# EAGLE schematic MC-10 Schematics (EAGLE 7.2.0)
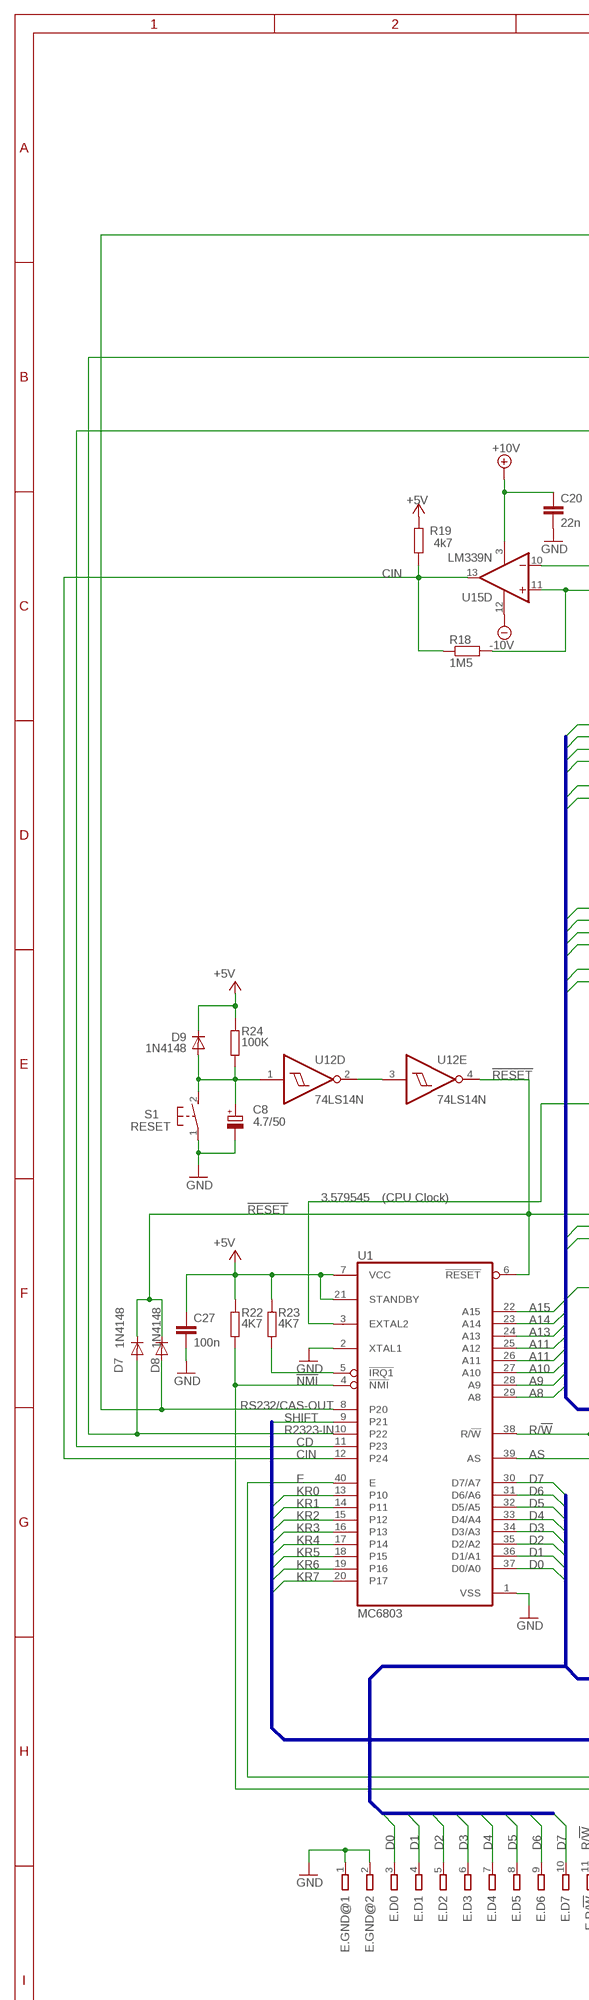
[diagram p0: schematic, sheet 1, part 1 of 2]
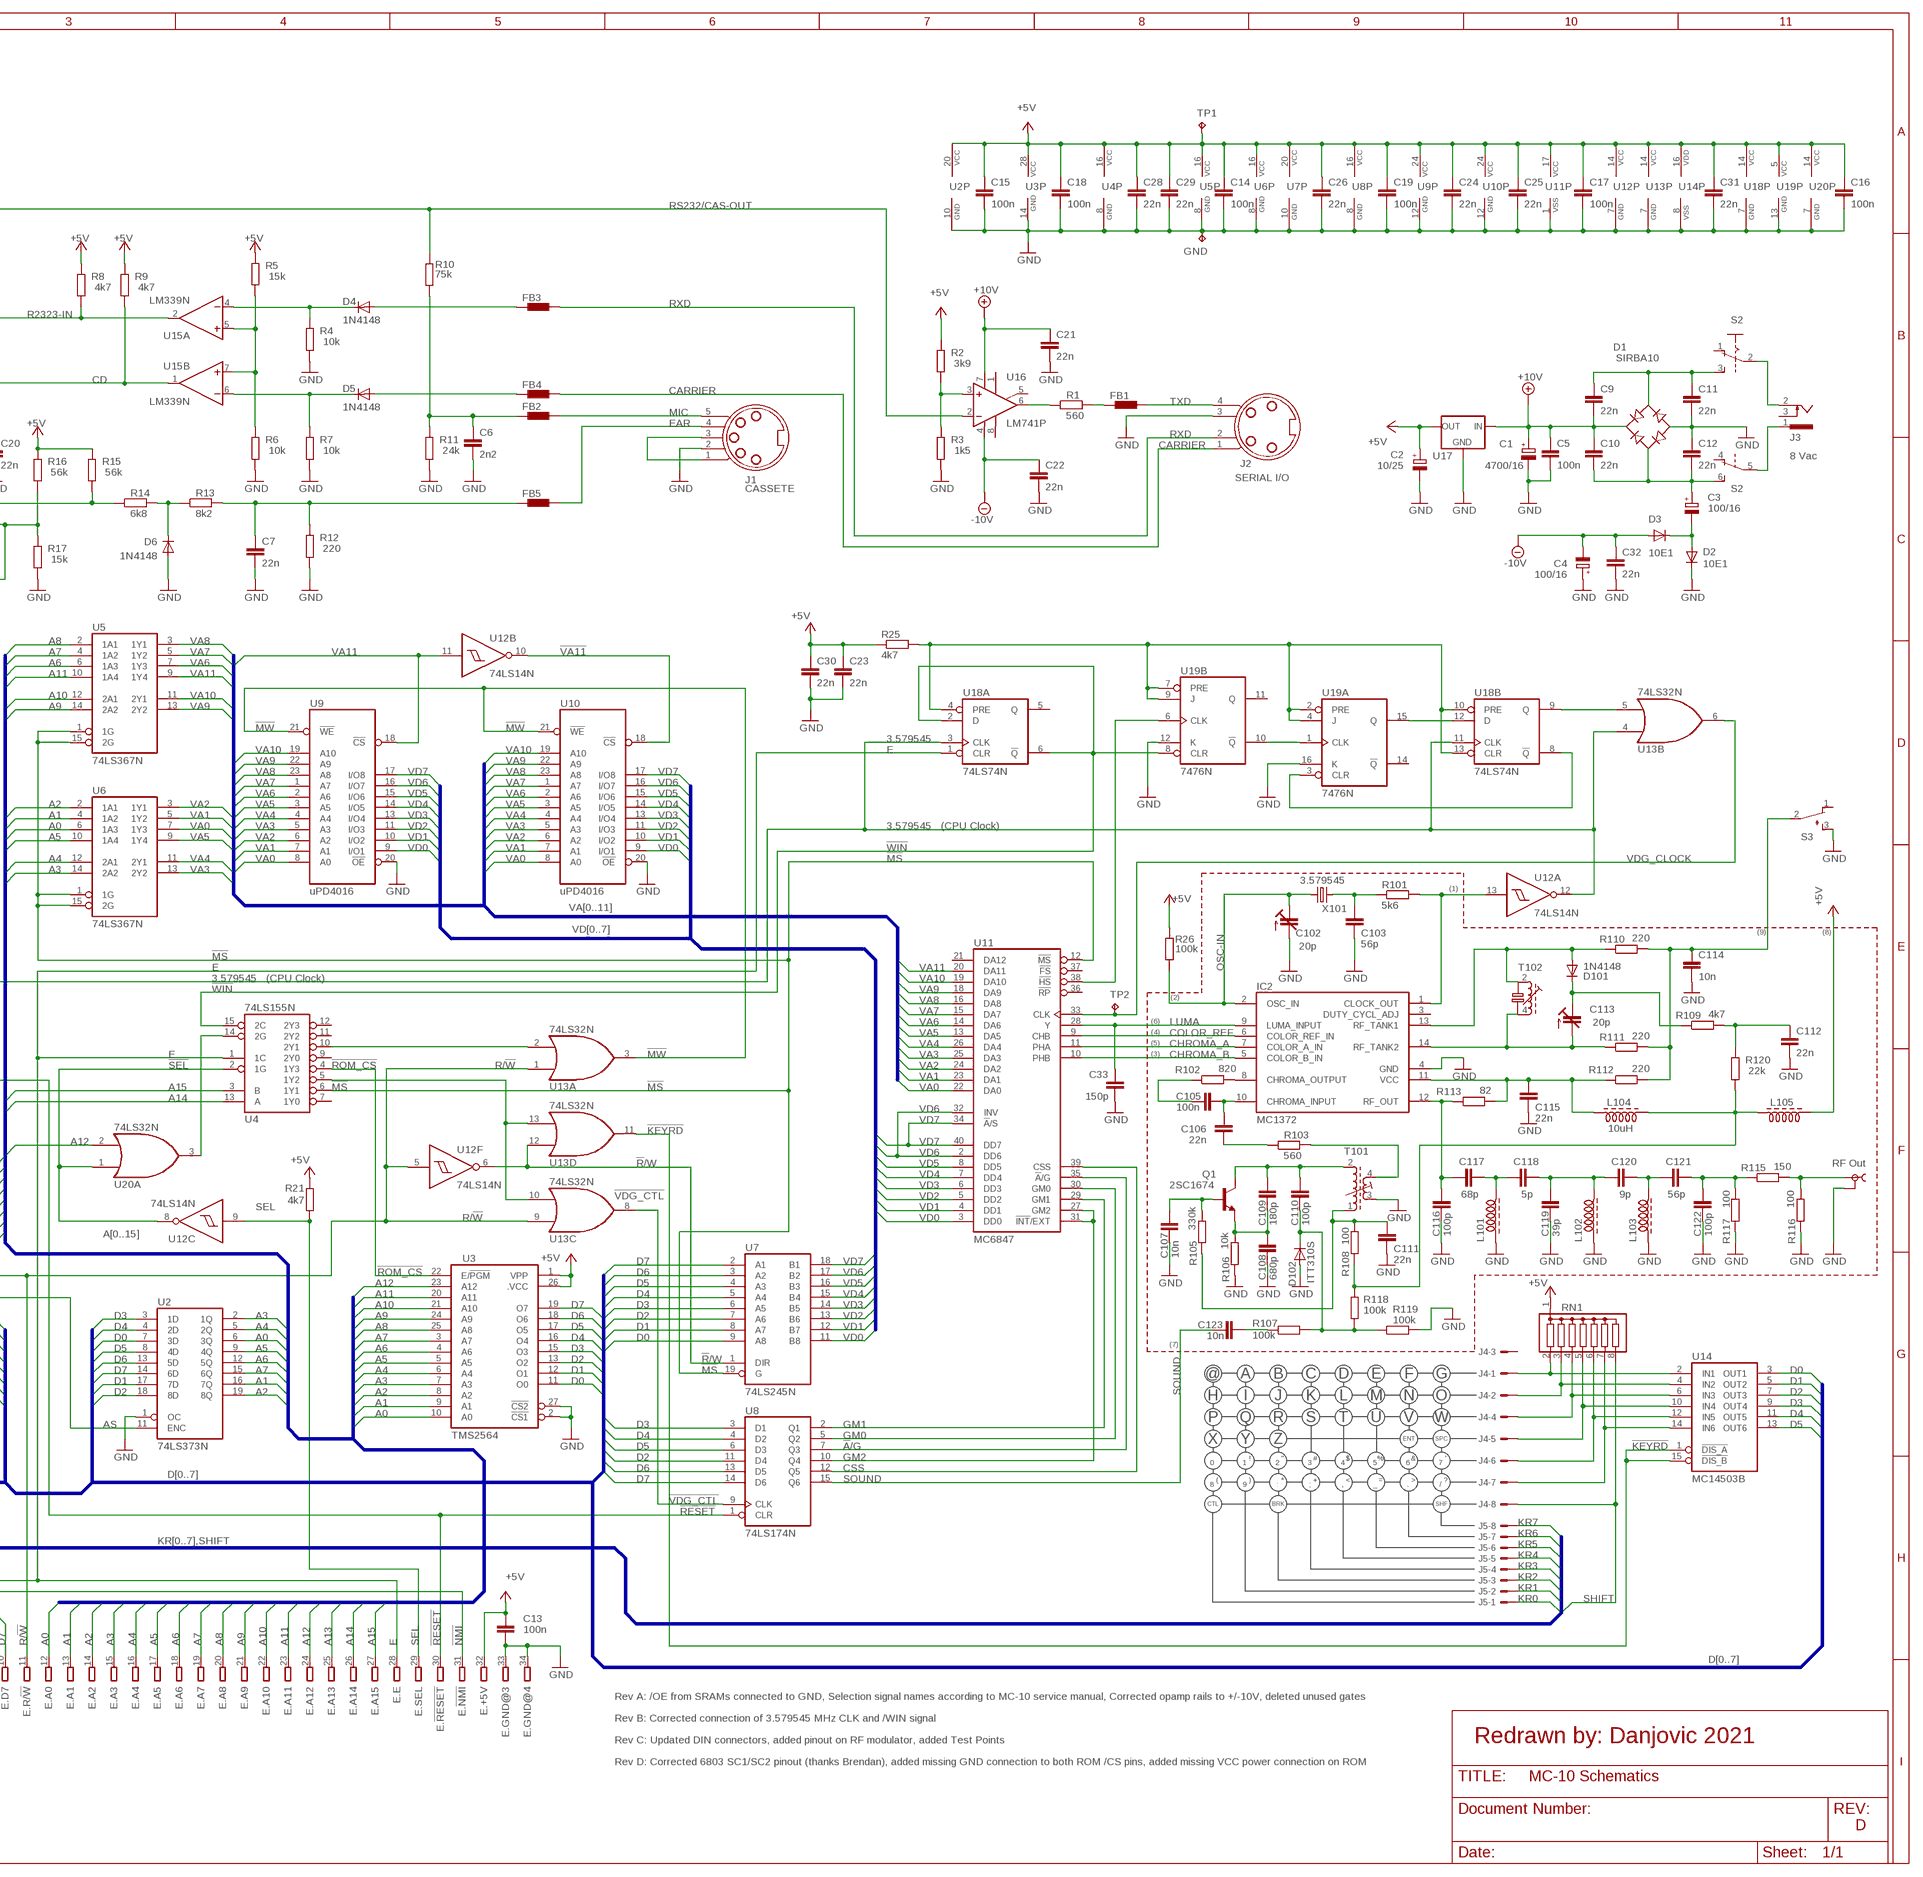
[diagram p1: schematic, sheet 1, part 2 of 2]

## Parts
C1  4700/16  CPOL-EUE7.5-18  [E7,5-18]
C2  10/25  CPOL-EUE1.8-4  [E1,8-4]
C3  100/16  CPOL-EUE15-5AXIAL  [E15-5]
C4  100/16  CPOL-EUE15-5AXIAL  [E15-5]
C5  100n  C-EU050-024X044  [C050-024X044]
C6  2n2  C-EU050-024X044  [C050-024X044]
C7  22n  C-EU050-024X044  [C050-024X044]
C8  4.7/50  CPOL-EUE1.8-4  [E1,8-4]
C9  22n  C-EU050-024X044  [C050-024X044]
C10  22n  C-EU050-024X044  [C050-024X044]
C11  22n  C-EU050-024X044  [C050-024X044]
C12  22n  C-EU050-024X044  [C050-024X044]
C13  100n  C-EU050-024X044  [C050-024X044]
C14  100n  C-EU050-024X044  [C050-024X044]
C15  100n  C-EU050-024X044  [C050-024X044]
C16  100n  C-EU050-024X044  [C050-024X044]
C17  100n  C-EU050-024X044  [C050-024X044]
C18  100n  C-EU050-024X044  [C050-024X044]
C19  100n  C-EU050-024X044  [C050-024X044]
C20  22n  C-EU050-024X044  [C050-024X044]
C21  22n  C-EU050-024X044  [C050-024X044]
C22  22n  C-EU050-024X044  [C050-024X044]
C23  22n  C-EU050-024X044  [C050-024X044]
C24  22n  C-EU050-024X044  [C050-024X044]
C25  22n  C-EU050-024X044  [C050-024X044]
C26  22n  C-EU050-024X044  [C050-024X044]
C27  100n  C-EU050-024X044  [C050-024X044]
C28  22n  C-EU050-024X044  [C050-024X044]
C29  22n  C-EU050-024X044  [C050-024X044]
C30  22n  C-EU050-024X044  [C050-024X044]
C31  22n  C-EU050-024X044  [C050-024X044]
C32  22n  C-EU050-024X044  [C050-024X044]
C33  150p  C-EU025-024X044  [C025-024X044]
C102  20p  C-TRIMM3008  [3008]
C103  56p  C-EU025-024X044  [C025-024X044]
C105  100n  C-EU050-024X044  [C050-024X044]
C106  22n  C-EU050-024X044  [C050-024X044]
C107  10n  C-EU025-024X044  [C025-024X044]
C108  680p  C-EU025-024X044  [C025-024X044]
C109  180p  C-EU025-024X044  [C025-024X044]
C110  100p  C-EU025-024X044  [C025-024X044]
C111  22n  C-EU025-024X044  [C025-024X044]
C112  22n  C-EU025-024X044  [C025-024X044]
C113  20p  C-TRIMM3008  [3008]
C114  10n  C-EU025-024X044  [C025-024X044]
C115  22n  C-EU025-024X044  [C025-024X044]
C116  100p  C-EU025-024X044  [C025-024X044]
C117  68p  C-EU025-024X044  [C025-024X044]
C118  5p  C-EU025-024X044  [C025-024X044]
C119  39p  C-EU025-024X044  [C025-024X044]
C120  9p  C-EU025-024X044  [C025-024X044]
C121  56p  C-EU025-024X044  [C025-024X044]
C122  100p  C-EU025-024X044  [C025-024X044]
C123  10n  C-EU025-024X044  [C025-024X044]
D1  SIRBA10  RECTIFIER-SKBB  [SKBB]
D2  10E1  DIODE-D-7.5  [D-7.5]
D3  10E1  DIODE-D-7.5  [D-7.5]
D4  1N4148  1N4148DO35-7  [DO35-7]
D5  1N4148  1N4148DO35-7  [DO35-7]
D6  1N4148  1N4148DO35-7  [DO35-7]
D7  1N4148  1N4148DO35-7  [DO35-7]
D8  1N4148  1N4148DO35-7  [DO35-7]
D9  1N4148  1N4148DO35-7  [DO35-7]
D101  1N4148  1N4148DO35-7  [DO35-7]
D102  ITT310S  1N4148DO35-7  [DO35-7]
E.  EXPANSION  [EXPANSION_PORT]
FB1  BL01RN1A  [BL01RN1A]
FB2  BL01RN1A  [BL01RN1A]
FB3  BL01RN1A  [BL01RN1A]
FB4  BL01RN1A  [BL01RN1A]
FB5  BL01RN1A  [BL01RN1A]
GND  TPPAD1-13  [P1-13]
IC2  MC1372  [DIL14]
J1  DS-4-05  [MC-10_DIN05S]
J2  DS-4-04  [MC-10_DIN04S]
J3  733980-62  [733980-62]
J4  22-27-2081-08  [6410-08]
J5  22-27-2081-08  [6410-08]
L101  Z15/05CCW  [Z15/05]
L102  Z15/05CCW  [Z15/05]
L103  Z15/05CCW  [Z15/05]
L104  10uH  Z15/05CCW  [Z15/05]
L105  10uH  Z15/05CCW  [Z15/05]
Q1  2SC1674  BF494-NPN-TO92-CEB  [TO92-CEB]
R1  560  R-EU_0204/7  [0204/7]
R2  3k9  R-EU_0204/7  [0204/7]
R3  1k5  R-EU_0204/7  [0204/7]
R4  10k  R-EU_0204/7  [0204/7]
R5  15k  R-EU_0204/7  [0204/7]
R6  10k  R-EU_0204/7  [0204/7]
R7  10k  R-EU_0204/7  [0204/7]
R8  4k7  R-EU_0204/7  [0204/7]
R9  4k7  R-EU_0204/7  [0204/7]
R10  75k  R-EU_0204/7  [0204/7]
R11  24k  R-EU_0204/7  [0204/7]
R12  220  R-EU_0204/7  [0204/7]
R13  8k2  R-EU_0204/7  [0204/7]
R14  6k8  R-EU_0204/7  [0204/7]
R15  56k  R-EU_0204/7  [0204/7]
R16  56k  R-EU_0204/7  [0204/7]
R17  15k  R-EU_0204/7  [0204/7]
R18  1M5  R-EU_0204/7  [0204/7]
R19  4k7  R-EU_0204/7  [0204/7]
R21  4k7  R-EU_0204/7  [0204/7]
R22  4K7  R-EU_0204/7  [0204/7]
R23  4K7  R-EU_0204/7  [0204/7]
R24  100K  R-EU_0204/7  [0204/7]
R25  4k7  R-EU_0204/7  [0204/7]
R26  100k  R-EU_0204/7  [0204/7]
R101  5k6  R-EU_0204/7  [0204/7]
R102  820  R-EU_0204/7  [0204/7]
R103  560  R-EU_0204/7  [0204/7]
R105  330k  R-EU_0204/7  [0204/7]
R106  10k  R-EU_0204/7  [0204/7]
R107  100k  R-EU_0204/7  [0204/7]
R108  100  R-EU_0204/7  [0204/7]
R109  4k7  R-EU_0204/7  [0204/7]
R110  220  R-EU_0204/7  [0204/7]
R111  220  R-EU_0204/7  [0204/7]
R112  220  R-EU_0204/7  [0204/7]
R113  82  R-EU_0204/7  [0204/7]
R115  150  R-EU_0204/7  [0204/7]
R116  100  R-EU_0204/7  [0204/7]
R117  100  R-EU_0204/7  [0204/7]
R118  100k  R-EU_0204/7  [0204/7]
R119  100k  R-EU_0204/7  [0204/7]
R120  22k  R-EU_0204/7  [0204/7]
RN1  G07R  [SIL8]
S1  RESET  31-XX  [B3F-31XX]
S2  A68-A31  [A68-A31]
S3  TL32PO  [TL3XPO]
T101  71-4-2143  [71-5]
T102  71K1-2-4  [71K]
TP1  TPPAD1-13  [P1-13]
TP2  TPPAD1-13  [P1-13]
U1  MC6803  MC6803P  [DIL40]
U2  74LS373N  [DIL20]
U3  TMS2564  TMS2564JL  [DIL28]
U4  74LS155N  [DIL16]
U5  74LS367N  74HC367N  [DIL16]
U6  74LS367N  74HC367N  [DIL16]
U7  74LS245N  [DIL20]
U8  74LS174N  [DIL16]
U9  uPD4016  UPD4016"  [DIL24]
U10  uPD4016  UPD4016"  [DIL24]
U11  MC6847  [DIL40]
U12  74LS14N  [DIL14]
U13  74LS32N  [DIL14]
U14  MC14503B  MC14503BN  [DIL16]
U15  LM339N  [DIL14]
U16  LM741P  [DIL08]
U17  78XXL  [78XXL]
U18  74LS74N  [DIL14]
U19  7476N  [DIL16]
U20  74LS32N  [DIL14]
X1  RF Out  TOBU3  [TOBU3]
X101  3.579545  CRYSTALHC49U70  [HC49U70]

## Nets
3.579545: U1.3(EXTAL2) U12.12(A:O) U13.4(B:I0) U18.3(A:CLK) U18.11(B:CLK)
!A!/G: U8.7(Q3) U11.35(!A!/G)
!IRQ: R23.2 U1.5(!IRQ1)
!KEYRD: U13.11(D:O) U14.1(!DIS_A!) U14.15(!DIS_B!)
!MS: U4.6(1Y1) U5.1(1G) U5.15(2G) U6.1(1G) U6.15(2G) U7.19(G) U11.12(!MS)
!MW: U9.21(!WE) U10.21(!WE) U13.3(A:O)
!NMI: E..31 R22.2 U1.4(!NMI)
!R!/W: U7.1(DIR) U12.6(F:O) U13.12(D:I0)
!RESET: D7.C D8.C E..30 U1.6(!RESET!) U8.1(CLR) U12.4(E:O)
!ROM_CS!: U3.22(E/!PGM) U4.4(1Y3)
!SEL: U4.2(1G) U12.8(C:O) U20.1(A:I0)
!VA11: U10.18(!CS) U12.10(B:O)
!VDG_CTL: U8.9(CLK) U13.8(C:O)
!WIN: U4.15(2C) U18.2(A:D) U18.6(A:!Q) U19.8(B:CLR)
+5V: C2.+ C13.1 C14.1 C15.1 C16.1 C17.1 C18.1 C19.1 C23.1 C24.1 C25.1 C26.1 C27.1 C28.1 C29.1 C30.1 C31.1 D9.C E..32 L105.1 R2.2 R5.2 R8.2 R9.2 R15.2 R16.2 R19.2 R21.1 R22.1 R23.1 R24.1 R25.1 R26.2 RN1.1 TP1.TP U1.7(VCC) U1.21(STANDBY) U2.20(VCC) U3.1(VPP) U3.26(.VCC) U3.28(VCC) U4.16(VCC) U5.16(VCC) U6.16(VCC) U7.20(VCC) U8.16(VCC) U9.24(VCC) U10.24(VCC) U11.17(VCC) U12.14(P:VCC) U13.14(P:VCC) U14.16(VDD) U17.OUT U18.14(P:VCC) U19.5(P:VCC) U20.14(P:VCC)
+10V: C1.+ C5.1 C9.2 C10.1 C20.1 C21.1 D1.+ U15.3(P:V+) U16.7(V+) U17.IN
-10V: C4.- C22.1 C32.1 D3.A U15.12(P:GND) U16.4(V-)
A0: E..12 U2.6(3Q) U3.10(A0) U6.6(1A3)
A1: E..13 U2.16(7Q) U3.9(A1) U6.4(1A2)
A2: E..14 U2.19(8Q) U3.8(A2) U6.2(1A1)
A3: E..15 U2.2(1Q) U3.7(A3) U6.14(2A2)
A4: E..16 U2.5(2Q) U3.6(A4) U6.12(2A1)
A5: E..17 U2.9(4Q) U3.5(A5) U6.10(1A4)
A6: E..18 U2.12(5Q) U3.4(A6) U5.6(1A3)
A7: E..19 U2.15(6Q) U3.3(A7) U5.4(1A2)
A8: E..20 U1.29(A8) U3.25(A8) U5.2(1A1)
A9: E..21 U1.28(A9) U3.24(A9) U5.14(2A2)
A10: E..22 U1.27(A10) U3.21(A10) U5.12(2A1)
A11: E..23 U1.25(A12) U1.26(A11) U3.20(A11) U5.10(1A4)
A12: E..24 U3.23(A12) U20.2(A:I1)
A13: E..25 U1.24(A13)
A14: E..26 U1.23(A14) U4.13(A)
A15: E..27 U1.22(A15) U4.3(B)
AS: U1.39(AS) U2.11(ENC)
CARRIER: FB4.2 J2.1
CD: R9.1 U1.11(P23) U15.1(B:OUT)
CHROMA_A: IC2.7(COLOR_A_IN) U11.11(PHA)
CHROMA_B: IC2.5(COLOR_B_IN) U11.10(PHB)
CIN: R18.1 R19.1 U1.12(P24) U15.13(D:OUT)
CLK-OUT: IC2.1(CLOCK_OUT) R101.2 U12.13(A:I)
COLOR_REF: IC2.6(COLOR_REF_IN) U11.9(CHB)
CSS: U8.12(Q5) U11.39(CSS)
D0: E..3 U1.37(D0/A0) U2.7(3D) U3.11(O0) U7.9(A8) U14.3(OUT1)
D1: E..4 U1.36(D1/A1) U2.17(7D) U3.12(O1) U7.8(A7) U14.5(OUT2)
D2: E..5 U1.35(D2/A2) U2.18(8D) U3.13(O2) U7.7(A6) U8.11(D4) U14.7(OUT3)
D3: E..6 U1.34(D3/A3) U2.3(1D) U3.15(O3) U7.6(A5) U8.3(D1) U14.9(OUT4)
D4: E..7 U1.33(D4/A4) U2.4(2D) U3.16(O4) U7.5(A4) U8.4(D2) U14.11(OUT5)
D5: E..8 U1.32(D5/A5) U2.8(4D) U3.17(O5) U7.4(A3) U8.6(D3) U14.13(OUT6)
D6: E..9 U1.31(D6/A6) U2.13(5D) U3.18(O6) U7.3(A2) U8.13(D5)
D7: E..10 U1.30(D7/A7) U2.14(6D) U3.19(O7) U7.2(A1) U8.14(D6)
E: E..28 U1.40(E) U4.1(1C) U18.1(A:CLR)
EAR: FB5.2 J1.4
GM0: U8.5(Q2) U11.30(GM0)
GM1: U8.2(Q1) U11.29(GM1)
GM2: U8.10(Q4) U11.27(GM2) U11.31(!INT!/EXT)
GND: C1.- C2.- C4.+ C5.2 C6.2 C7.2 C8.- C11.2 C12.1 C13.2 C14.2 C15.2 C16.2 C17.2 C18.2 C19.2 C20.2 C21.2 C22.2 C23.2 C24.2 C25.2 C26.2 C27.2 C28.2 C29.2 C30.2 C31.2 C32.2 C33.2 C102.-(A) C103.2 C107.2 C108.2 C111.2 C112.2 C114.2 C115.2 C116.2 C119.2 C122.2 D1.- D2.C D6.A D102.A E..1 E..2 E..33 E..34 GND.TP IC2.4(GND) J1.2 J2.3 L101.1 L102.1 L103.1 R3.1 R4.1 R6.1 R7.1 R11.1 R12.1 R17.1 R106.1 R116.1 R117.1 R119.2 S1.1(P) S3.3(S) T101.3(E2) U1.1(VSS) U1.2(XTAL1) U2.1(OC) U2.10(GND) U3.2(!CS1) U3.14(GND) U3.27(!CS2) U4.8(GND) U5.8(GND) U6.8(GND) U7.10(GND) U8.8(GND) U9.12(GND) U9.20(!OE) U10.12(GND) U10.20(!OE) U11.1(GND) U12.7(P:GND) U13.7(P:GND) U14.8(VSS) U17.GND U18.7(P:GND) U19.12(B:K) U19.13(P:GND) U19.16(A:K) U20.7(P:GND) X1.2 X1.2@1 X1.2@2
KB0: J4.1 RN1.2 U14.2(IN1)
KB1: J4.2 RN1.3 U14.4(IN2)
KB2: J4.4 RN1.4 U14.6(IN3)
KB3: J4.5 RN1.5 U14.10(IN4)
KB4: J4.6 RN1.6 U14.12(IN5)
KB5: J4.7 RN1.7 U14.14(IN6)
KR0: J5.1 U1.13(P10)
KR1: J5.2 U1.14(P11)
KR2: J5.3 U1.15(P12)
KR3: J5.4 U1.16(P13)
KR4: J5.5 U1.17(P14)
KR5: J5.6 U1.18(P15)
KR6: J5.7 U1.19(P16)
KR7: J5.8 U1.20(P17)
LUMA: C33.1 IC2.9(LUMA_INPUT) U11.28(Y)
MIC: FB2.2 J1.5
N$1: IC2.8(CHROMA_OUTPUT) R102.2
N$2: D4.C R4.2 U15.4(A:-IN)
N$4: U4.14(2G) U20.3(A:O)
N$5: R25.2 U18.4(A:PRE) U18.10(B:PRE) U18.13(B:CLR) U19.2(A:PRE) U19.4(A:J) U19.7(B:PRE) U19.9(B:J)
N$6: U4.10(2Y1) U13.2(A:I1)
N$7: U4.5(1Y2) U13.10(C:I1) U13.13(D:I1)
N$8: C105.2 C106.1 IC2.10(CHROMA_INPUT)
N$9: C103.1 R101.1 X101.2
N$10: U18.8(B:!Q) U19.3(A:CLR)
N$12: U19.1(A:CLK) U19.10(B:!Q)
N$13: U18.12(B:D) U19.15(A:Q)
N$14: U13.5(B:I1) U18.9(B:Q)
N$15: C105.1 R102.1
N$16: U11.38(!HS) U19.6(B:CLK)
N$17: C115.1 IC2.11(VCC) L104.2 R112.1 R113.2
N$18: D101.A IC2.13(RF_TANK1) R110.1 T102.2(A)
N$19: C113.-(A) IC2.14(RF_TANK2) R111.1 T102.4(E)
N$20: C113.+(E) D101.C R109.1
N$21: C116.1 C117.1 IC2.12(RF_OUT) R113.1
N$22: C117.2 C118.1 L101.2
N$23: C118.2 C119.1 C120.1 L102.2
N$24: R115.2 R116.2 X1.1
N$25: C120.2 C121.1 L103.2
N$26: C121.2 C122.1 R115.1 R117.2
N$27: C106.2 R103.1
N$28: R103.2 T101.4(A2)
N$29: J3.2 S2.2(A:P)
N$30: C109.1 C110.1 Q1.C T101.2(A1)
N$31: C112.1 R109.2 R120.2
N$32: C107.1 Q1.B R105.2
N$33: C108.1 C109.2 Q1.E R106.2
N$34: C123.1 R107.1
N$35: C110.2 D102.C R107.2 R118.1 R119.1
N$36: C114.1 R110.2 R111.2 R112.2 S3.2(P)
N$37: C111.1 R105.1 R108.2 T101.1(E1)
N$38: L104.1 L105.2 R108.1 R118.2 R120.1
N$39: J3.1 S2.5(B:P)
N$40: R2.1 R3.2 U16.3(+IN)
N$41: C3.- D2.A D3.C
N$42: C9.1 C11.1 D1.AC1 S2.3(A:S)
N$43: C3.+ C10.2 C12.2 D1.AC2 S2.6(B:S)
N$44: R1.1 U16.6(OUT)
N$46: FB1.1 R1.2
N$49: D4.A FB3.1
N$50: R5.1 R6.2 U15.5(A:+IN) U15.7(B:+IN)
N$52: D5.C R7.2 U15.6(B:-IN)
N$53: D5.A FB4.1
N$58: R16.1 R17.2 R18.2 U15.11(D:+IN)
N$59: R14.1 R15.1 U15.10(D:-IN)
N$60: C6.1 FB2.1 R10.2 R11.2
N$62: D6.C R13.1 R14.2
N$63: C7.1 FB5.1 R12.2 R13.2
N$65: J1.1 J1.3
OSC-IN: C102.+(E) IC2.2(OSC_IN) R26.1 X101.1
R2323-IN: D7.A R8.1 U1.10(P22) U15.2(A:OUT)
R/!W: E..11 U1.38(R/!W!) U12.5(F:I) U13.1(A:I0) U13.9(C:I0)
RESET: U12.2(D:O) U12.3(E:I)
RS232/CAS-OUT: D8.A R10.1 U1.8(P20) U16.2(-IN)
RST_SW: C8.+ D9.A R24.2 S1.2(S) U12.1(D:I)
RXD: FB3.2 J2.2
SEL: E..29 R21.2 U12.9(C:I)
SHIFT: J4.8 RN1.8 U1.9(P21)
SOUND: C123.2 U8.15(Q6)
TXD: FB1.2 J2.4
VA0: U6.7(1Y3) U9.8(A0) U10.8(A0) U11.22(DA0)
VA1: U6.5(1Y2) U9.7(A1) U10.7(A1) U11.23(DA1)
VA2: U6.3(1Y1) U9.6(A2) U10.6(A2) U11.24(DA2)
VA3: U6.13(2Y2) U9.5(A3) U10.5(A3) U11.25(DA3)
VA4: U6.11(2Y1) U9.4(A4) U10.4(A4) U11.26(DA4)
VA5: U6.9(1Y4) U9.3(A5) U10.3(A5) U11.13(DA5)
VA6: U5.7(1Y3) U9.2(A6) U10.2(A6) U11.14(DA6)
VA7: U5.5(1Y2) U9.1(A7) U10.1(A7) U11.15(DA7)
VA8: U5.3(1Y1) U9.23(A8) U10.23(A8) U11.16(DA8)
VA9: U5.13(2Y2) U9.22(A9) U10.22(A9) U11.18(DA9)
VA10: U5.11(2Y1) U9.19(A10) U10.19(A10) U11.19(DA10)
VA11: U5.9(1Y4) U9.18(!CS) U11.20(DA11) U12.11(B:I)
VD0: U7.11(B8) U9.9(I/O1) U10.9(I/O1) U11.3(DD0)
VD1: U7.12(B7) U9.10(I/O2) U10.10(I/O2) U11.4(DD1)
VD2: U7.13(B6) U9.11(I/O3) U10.11(I/O3) U11.5(DD2)
VD3: U7.14(B5) U9.13(I/O4) U10.13(I/O4) U11.6(DD3)
VD4: U7.15(B4) U9.14(I/O5) U10.14(I/O5) U11.7(DD4)
VD5: U7.16(B3) U9.15(I/O6) U10.15(I/O6) U11.8(DD5)
VD6: U7.17(B2) U9.16(I/O7) U10.16(I/O7) U11.2(DD6) U11.32(INV)
VD7: U7.18(B1) U9.17(I/O8) U10.17(I/O8) U11.34(!A!/S) U11.40(DD7)
VDG_CLOCK: TP2.TP U11.33(CLK) U13.6(B:O)
Unconnected: IC2.3(DUTY_CYCL_ADJ) J3.3 J4.3 S2.1(A:O) S2.4(B:O) S3.1(O) T101.S1 T101.S2 T102.S1 T102.S2 U4.7(1Y0) U4.9(2Y0) U4.11(2Y2) U4.12(2Y3) U11.21(DA12) U11.36(!RP) U11.37(!FS) U15.8(C:-IN) U15.9(C:+IN) U15.14(C:OUT) U16.1(ON1) U16.5(ON2) U16.8(OPT) U18.5(A:Q) U19.11(B:Q) U19.14(A:!Q) U20.4(B:I0) U20.5(B:I1) U20.6(B:O) U20.8(C:O) U20.9(C:I0) U20.10(C:I1) U20.11(D:O) U20.12(D:I0) U20.13(D:I1)

## Buses
D[0..7]
A[0..15]
VA[0..11]
VD[0..7]
KR[0..7],SHIFT

## Notes on the sheet
- 8 Vac
- SERIAL I/O
- CASSETE
- (CPU Clock)
- (1)
- (9) | (8)
- (CPU Clock)
- (2)
- (6)
- (4)
- (5)
- (3)
- (CPU Clock)
- (7)
- @ | A | B | C | D | E | F | G
- H | I | J | K | L | M | N | O
- P | Q | R | S | T | U | V | W
- X | Y | Z | ENT | SPC
- ! | " | # | $ | % | & | '
- 0 | 1 | 2 | 3 | 4 | 5 | 6 | 7
- ( | ) | * | + | < | = | > | ?
- 8 | 9 | : | ; | , | _ | . | /
- CTL | BRK | SHF
- Rev A: /OE from SRAMs connected to GND, Selection signal names according to MC-10 service manual, Corrected opamp rails to +/-10V, deleted unused gates
- Rev B: Corrected connection of 3.579545 MHz CLK and /WIN signal
- Rev C: Updated DIN connectors, added pinout on RF modulator, added Test Points | Redrawn by: Danjovic 2021
- Rev D: Corrected 6803 SC1/SC2 pinout (thanks Brendan), added missing GND connection to both ROM /CS pins, added missing VCC power connection on ROM
- D

## Library data of the parts
C1-C4 C8 = rcl:CPOL-EU: POLARIZED CAPACITOR, European symbol
C5-C7 C9-C33 C103 C105-C112 C114-C123 = rcl:C-EU: CAPACITOR, European symbol
C102 C113 = c-trimm:C-TRIMM: Trimm capacitor; OC_FARNELL: unknown; OC_NEWARK: unknown
D1 = rectifier:RECTIFIER-: Rectifier
D2 D3 = diode:DIODE-: DIODE
D4-D9 D101 D102 = diode:1N4148: DIODE high speed (Philips)
E. = MC-10:EXPANSION: MC-10 Expansion port connector
FB1-FB5 = inductors:BL0: Noise Suppression Products/EMI Suppression Filters, Lead EMIFIL(R) Inductor Type Source: http://www.murata.com .. BL01RN1_DS.pdf
GND TP1 TP2 = testpad:TP: Test pad
IC2 = MC-10:MC1372: Color TV Video Modulator
J1 = MC-10:DS-4-05: DIN Socket 5 pin 180 degree
J2 = MC-10:DS-4-04: DIN Socket 4 pin 210 degree
J3 = con-conrad:73398?: FEMALE PRINT CONNECTOR Niedervolt-Steckverbinder Distributor Conrad
J4 J5 = con-molex:22-?-08: CONNECTOR wire to board 2.54 mm (.1 inch) pitch header; OC_FARNELL: unknown; OC_NEWARK: unknown
L101-L105 = inductor-neosid:Z?CCW: CHOKE free-suspension choke/nominal inductance winding counter clockwise; OC_FARNELL: unknown; OC_NEWARK: unknown
Q1 = transistor-neu-to92:*-NPN-: NPN Transistror
R1-R19 R21-R26 R101-R103 R105-R113 R115-R120 = rcl:R-EU_: RESISTOR, European symbol
RN1 = resistor-sil:G07R: SIL RESISTOR; OC_FARNELL: unknown; OC_NEWARK: unknown
S1 = switch-omron:31-XX: OMRON SWITCH; MPN: B3F-3100; OC_FARNELL: 959704; OC_NEWARK: 36M3582
S2 = switch:A68-A31: SLIDING SWITCH Siemens, distributor Buerklin, 11G766
S3 = switch:TL32PO: TINY SWITCH ON - MOM Source: http://www2.produktinfo.conrad.com/datenblaetter/700000-724999/705152-da-01-de-Subminiaturschalter_TL_36YO.pdf
T101 = inductor-neosid:71-4-: TRANSFORMER adjustable filter transformer; OC_FARNELL: unknown; OC_NEWARK: unknown
T102 = inductor-neosid:71K1-: FILTER adjustable filter coil, type K; OC_FARNELL: unknown; OC_NEWARK: unknown
U1 = MC-10:MC6803: 8 Bit Microcontroller/Microprocessor
U2 = 74xx-us:74*373: Octal D type transparent LATCH, edge triggered
U3 = MC-10:TMS2564JL: 65536 Bit Erasable Programable Read-Only Memory
U4 = 74xx-us:74*155: Dual 2-line to 4-line data DECODER/DEMULTIPLEXER
U5 U6 = 74xx-eu:74*367: Hex BUS DRIVER, 3-state
U7 = 74xx-us:74*245: Octal BUS TRANSCEIVER, 3-state
U8 = 74xx-us:74*174: Hex D type FLIP FLOP, clear
U9 U10 = MC-10:UPD4016: 2048 x 8 Bit Static NMOS RAM
U11 = MC-10:MC6847: Video Display Generator (VDG)
U12 = 74xx-us:74*14: Hex schmitt trigger INVERTER
U13 U20 = 74xx-us:74*32: Quad 2-input OR gate
U14 = MC-10:MC14503B: Hex BUS DRIVER, 3-state
U15 = linear:LM339: Low Power Low Offset Voltage Quad Comparators with open collector; LM139/LM239/LM339/LM2901/LM3302
U16 = linear:*741: OP AMP
U17 = v-reg:78XXL: VOLTAGE REGULATOR
U18 = 74xx-us:74*74: Dual D type positive edge triggered FLIP FLOP, preset and clear
U19 = 74xx-eu:74*76: Dual J-K FLIP FLOP, preset and clear
X1 = con-hirschmann:TOBU3: Female Cinch CONNECTOR ( RCA Jack ); MF: FARNELL; MPN: TOBU 3; OC_FARNELL: 592791; OC_NEWARK: 06WX5914
X101 = crystal:CRYSTAL: CRYSTAL; OC_FARNELL: unknown; OC_NEWARK: unknown